# Altium project Tesis.PrjPcb (part 2 of 2)

## Sheet Fly-Back.SchDoc
size A4; DocumentNumber: 3; SheetNumber: 3; SheetTotal: 5
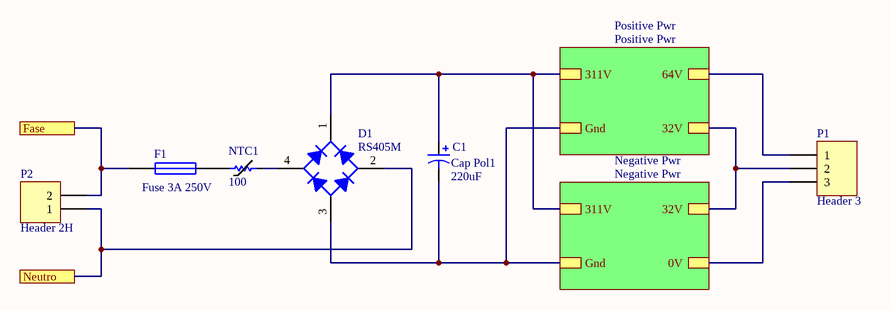
[diagram p12: Fly-Back.SchDoc]

### Parts
C1  Cap Pol1  value 220uF  [cap rad 100mm]
D1  RS405M  [RS405M]
F1  Fuse 3A 250V  [FUSE 3A]
NTC1  VALOR: 100  [RAD-0.3]  (hidden comment: Termistor NTC)
P1  Header 3  [bornera 3]
P2  Header 2H  [bornera 2]

### Sub-sheets
Negative Pwr = Negative Pwr: 311V, Gnd, 32V, 0V
Positive Pwr = Positive Pwr: 311V, Gnd, 64V, 32V

### Ports
Fase, Neutro

### Nets
Net*1_1: C1.1 D1.1(K) ; sheet Positive Pwr/311V, sheet Negative Pwr/311V
Net*1_3: C1.2 D1.3(A) ; sheet Positive Pwr/Gnd, sheet Negative Pwr/Gnd
Net*1_5: P1.2 ; sheet Positive Pwr/32V, sheet Negative Pwr/32V
Net*2_5: P1.3 ; sheet Negative Pwr/0V
NetC45_1: P1.1 ; sheet Positive Pwr/64V
NetD1_2: D1.2(C) P2.1 ; port Neutro
NetD1_4: D1.4(C) NTC1.1
NetF1_1: F1.1 P2.2 ; port Fase
NetF1_2: F1.2 NTC1.2

### Library data of the parts
C1 = Cap Pol1: Polarized Capacitor (Radial); Published: 8-Jun-2000; LatestRevisionDate: 17-Jul-2002; LatestRevisionNote: Re-released for DXP Platform.; PackageReference: RB7.6-15; Publisher: Altium Limited; PackageDescription: Polarized Capacitor (Radial); 2 Leads
D1 = Bridge1: Full Wave Diode Bridge; Published: 8-Jun-2000; LatestRevisionDate: 29-May-2009; LatestRevisionNote: Sch pins A & K swapped.; DatasheetVersion: E2732B; PackageReference: D-38; Publisher: Altium Limited; PackageDescription: Bridge Rectifier; 4 Terminals; Body 9.4 x 9.4 mm (typ); Pitch 5.08 mm
F1 = Fuse 1: Fuse; Published: 8-Jun-2000; LatestRevisionDate: 17-Jul-2002; LatestRevisionNote: Re-released for DXP Platform.; PackageReference: PIN-W2/E2.8; Publisher: Altium Limited; PackageDescription: Thru-Hole; 2 Leads
NTC1 = Termistor NTC: Termistor NTC SMD; PROVEEDOR: *; CODIGO STI: *; FABRICANTE: *
P1 = Header 3: Header, 3-Pin; LatestRevisionDate: 17-Jul-2002; LatestRevisionNote: Re-released for DXP Platform.; Publisher: Altium Limited
P2 = Header 2H: Header, 2-Pin, Right Angle; LatestRevisionDate: 17-Jul-2002; LatestRevisionNote: Re-released for DXP Platform.; Publisher: Altium Limited

## Sheet Positive Pwr.SchDoc
size A4
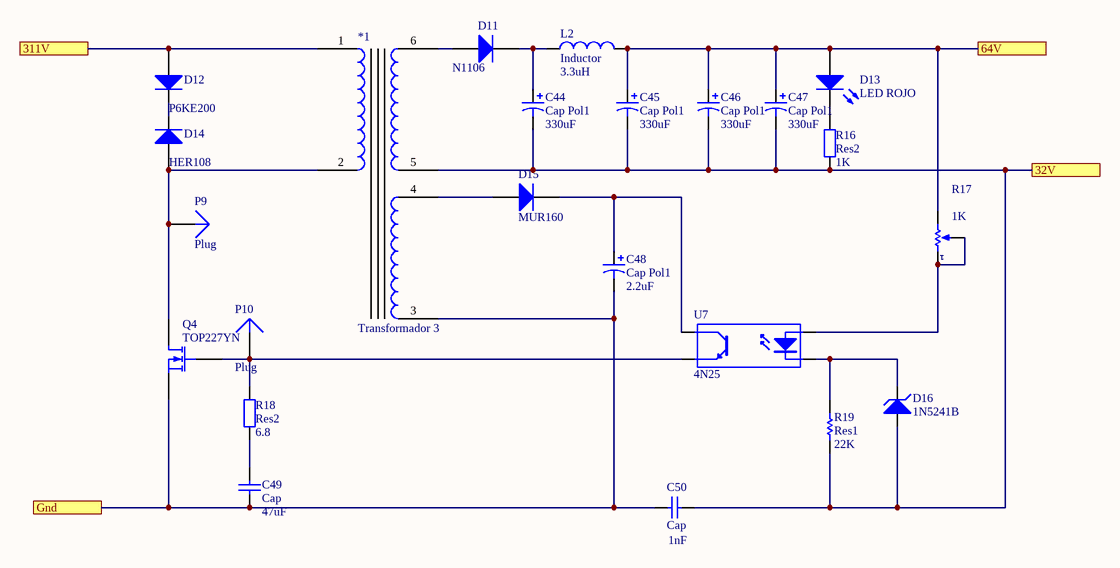
[diagram p13: Positive Pwr.SchDoc]

### Parts
*1  Transformador 3  [Transformador_flyback - duplicate]
C44  Cap Pol1  value 330uF  [CAPR D500 H1200 R200 mil]
C45  Cap Pol1  value 330uF  [CAPR D500 H1200 R200 mil]
C46  Cap Pol1  value 330uF  [CAPR D500 H1200 R200 mil]
C47  Cap Pol1  value 330uF  [CAPR D500 H1200 R200 mil]
C48  Cap Pol1  value 2.2uF  [CAPR D200 H450 R100 mil]
C49  Cap  value 47uF  [CAPR D250 H450 R100 mil]
C50  Cap  value 1nF  [RAD-0.2]
D11  N1106  [TO-220_A]
D12  P6KE200  [DO-15]
D13  LED ROJO  [Led 5mm ROJO]
D14  HER108  [DO-41]
D15  MUR160  [DO-41]
D16  VALOR: 1N5241B  [DO-41]  (hidden comment: Diodo Zener)
L2  Inductor  value 3.3uH  [Bobina 1.5*3]
P9  Plug  [PIN1]
P10  Plug  [PIN1]
Q4  TOP227YN  [TO-220AB]
R16  Res2  value 1K  [1206 resistor]
R17  VALOR: 1K  [Trimpot Horizontal]  (hidden comment: Trimpot)
R18  Res2  value 6.8  [1206 resistor]
R19  Res1  value 22K  [1206 resistor]
U7  4N25  [DIP-4]

### Ports
32V, 64V, 311V, Gnd

### Nets
Net*1_1: *1.1(L) D12.1(A) ; port 311V
Net*1_2: *1.2(L) D14.1(A) P9.1 Q4.3(D)
Net*1_3: *1.3(L) C48.2 C49.1 C50.1 Q4.2(S) ; port Gnd
Net*1_4: *1.4(L) D15.1(A)
Net*1_5: *1.5(L) C44.2 C45.2 C46.2 C47.2 C50.2 D16.1(A) R16.1 R19.1 ; port 32V
Net*1_6: *1.6(L) D11.3(A)
NetC44_1: C44.1 D11.1(K) L2.1
NetC45_1: C45.1 C46.1 C47.1 D13.1(A) L2.2 R17.2(BOT) ; port 64V
NetC48_1: C48.1 D15.2(K) U7.4(C)
NetC49_2: C49.2 R18.1
NetD12_2: D12.2(K) D14.2(K)
NetD13_2: D13.2(K) R16.2
NetD16_2: D16.2(K) R19.2 U7.2(K)
NetP10_1: P10.1 Q4.1(G) R18.2 U7.3(E)
NetR17_1: R17.1(TOP) R17.3(TAP) U7.1(A)

### Library data of the parts
C44-C48 = Cap Pol1: Polarized Capacitor (Radial); Published: 8-Jun-2000; LatestRevisionDate: 17-Jul-2002; LatestRevisionNote: Re-released for DXP Platform.; PackageReference: RB7.6-15; Publisher: Altium Limited; PackageDescription: Polarized Capacitor (Radial); 2 Leads
C49 C50 = Cap: Capacitor; Published: 8-Jun-2000; LatestRevisionDate: 17-Jul-2002; LatestRevisionNote: Re-released for DXP Platform.; PackageReference: RAD-0.3; Publisher: Altium Limited; PackageDescription: Radial Cap, Thru-Hole; 2 Leads; 0.3 in Pin Spacing
D11 D12 D14 D15 = Diode 1N4148: High Conductance Fast Diode; Published: 8-Jun-2000; LatestRevisionDate: 17-Jul-2002; LatestRevisionNote: Re-released for DXP Platform.; DatasheetVersion: 1997; PackageReference: DO-35; Publisher: Altium Limited; PackageDescription: Diode, Axial; Body 3.8 x 1.9 mm (LxDia. max), Lead Dia. 0.53 mm (max); Code_JEDEC: DO-204-AH; ComponentLink1Description: Manufacturer Link; ComponentLink1URL: http://www.fairchildsemi.com/; ComponentLink2Description: Datasheet; ComponentLink2URL: http://www.fairchildsemi.com/ds/1N%2F1N4148.pdf
D13 = LED0: Typical INFRARED GaAs LED; Published: 8-Jun-2000; LatestRevisionDate: 08-Jul-2005; LatestRevisionNote: Mech Layer 1 removed.; PackageReference: LED-0; Publisher: Altium Limited; PackageDescription: LED; 2 Leads
L2 = Inductor: Code_IEC: 1005; Published: 8-Jun-2000; LatestRevisionDate: 29-May-2009; LatestRevisionNote: IPC-7351 Footprint Added.; PackageReference: 0402-A; Publisher: Altium Limited; PackageDescription: Chip Inductor; Code_JEITA: 0402
Q4 = MOSFET-N: N-Channel MOSFET; Published: 8-Jun-2000; LatestRevisionDate: 17-Jul-2002; LatestRevisionNote: Re-released for DXP Platform.; PackageVersion: 1995/1996; PackageReference: E3; Publisher: Altium Limited; PackageDescription: TO, Flat Index; 3 In-Line, Axial Leads; Body Dia. 4.6mm; Lead Dia. 0.5 mm (max)
R16 R18 = Res2: Resistor; Published: 8-Jun-2000; LatestRevisionDate: 17-Jul-2002; LatestRevisionNote: Re-released for DXP Platform.; PackageReference: AXIAL-0.4; Publisher: Altium Limited; PackageDescription: Axial Device, Thru-Hole; 2 Leads; 0.4 in Pin Spacing
R17 = Trimpot: Preset; CODIGO STI: *; PROVEEDOR: *; FABRICANTE: *
R19 = Res1: Resistor; Published: 8-Jun-2000; LatestRevisionDate: 17-Jul-2002; LatestRevisionNote: Re-released for DXP Platform.; PackageReference: AXIAL-0.3; Publisher: Altium Limited; PackageDescription: Axial Device, Thru-Hole; 2 Leads; 0.3 in Pin Spacing
U7 = Optoisolator1: 4-Pin Phototransistor Optocoupler; Published: 24-Mar-1999; LatestRevisionDate: 04-Mar-2005; LatestRevisionNote: Sch pins 3 & 4 Swapped.; DatasheetVersion: Nov-2003; PackageReference: DIP-4; Publisher: Altium Limited
D16 = Diodo Zener: CODIGO STI: *; PROVEEDOR: *; FABRICANTE: *
P9 P10 = Plug: LatestRevisionDate: 17-Jul-2002; LatestRevisionNote: Re-released for DXP Platform.; Publisher: Altium Limited

## Sheet Negative Pwr.SchDoc
size A4
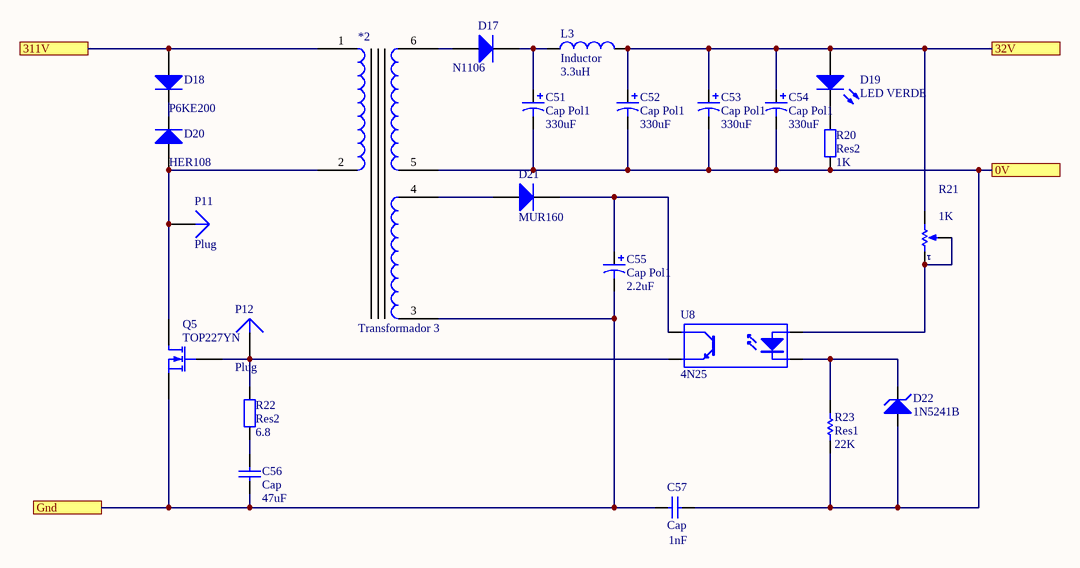
[diagram p14: Negative Pwr.SchDoc]

### Parts
*2  Transformador 3  [Transformador_flyback - duplicate]
C51  Cap Pol1  value 330uF  [CAPR D500 H1200 R200 mil]
C52  Cap Pol1  value 330uF  [CAPR D500 H1200 R200 mil]
C53  Cap Pol1  value 330uF  [CAPR D500 H1200 R200 mil]
C54  Cap Pol1  value 330uF  [CAPR D500 H1200 R200 mil]
C55  Cap Pol1  value 2.2uF  [CAPR D200 H450 R100 mil]
C56  Cap  value 47uF  [CAPR D250 H450 R100 mil]
C57  Cap  value 1nF  [RAD-0.2]
D17  N1106  [TO-220_A]
D18  P6KE200  [DO-15]
D19  LED VERDE  [Led 5mm ROJO]
D20  HER108  [DO-41]
D21  MUR160  [DO-41]
D22  VALOR: 1N5241B  [DO-41]  (hidden comment: Diodo Zener)
L3  Inductor  value 3.3uH  [Bobina 1.5*3]
P11  Plug  [PIN1]
P12  Plug  [PIN1]
Q5  TOP227YN  [TO-220AB]
R20  Res2  value 1K  [1206 resistor]
R21  VALOR: 1K  [Trimpot Horizontal]  (hidden comment: Trimpot)
R22  Res2  value 6.8  [1206 resistor]
R23  Res1  value 22K  [1206 resistor]
U8  4N25  [DIP-4]

### Ports
0V, 32V, 311V, Gnd

### Nets
Net*1_1: *2.1(L) D18.1(A) ; port 311V
Net*1_3: *2.3(L) C55.2 C56.1 C57.1 Q5.2(S) ; port Gnd
Net*1_5: C52.1 C53.1 C54.1 D19.1(A) L3.2 R21.2(BOT) ; port 32V
Net*2_2: *2.2(L) D20.1(A) P11.1 Q5.3(D)
Net*2_4: *2.4(L) D21.1(A)
Net*2_5: *2.5(L) C51.2 C52.2 C53.2 C54.2 C57.2 D22.1(A) R20.1 R23.1 ; port 0V
Net*2_6: *2.6(L) D17.3(A)
NetC51_1: C51.1 D17.1(K) L3.1
NetC55_1: C55.1 D21.2(K) U8.4(C)
NetC56_2: C56.2 R22.1
NetD18_2: D18.2(K) D20.2(K)
NetD19_2: D19.2(K) R20.2
NetD22_2: D22.2(K) R23.2 U8.2(K)
NetP12_1: P12.1 Q5.1(G) R22.2 U8.3(E)
NetR21_1: R21.1(TOP) R21.3(TAP) U8.1(A)

### Library data of the parts
C51-C55 = Cap Pol1: Polarized Capacitor (Radial); Published: 8-Jun-2000; LatestRevisionDate: 17-Jul-2002; LatestRevisionNote: Re-released for DXP Platform.; PackageReference: RB7.6-15; Publisher: Altium Limited; PackageDescription: Polarized Capacitor (Radial); 2 Leads
C56 C57 = Cap: Capacitor; Published: 8-Jun-2000; LatestRevisionDate: 17-Jul-2002; LatestRevisionNote: Re-released for DXP Platform.; PackageReference: RAD-0.3; Publisher: Altium Limited; PackageDescription: Radial Cap, Thru-Hole; 2 Leads; 0.3 in Pin Spacing
D17 D18 D20 D21 = Diode 1N4148: High Conductance Fast Diode; Published: 8-Jun-2000; LatestRevisionDate: 17-Jul-2002; LatestRevisionNote: Re-released for DXP Platform.; DatasheetVersion: 1997; PackageReference: DO-35; Publisher: Altium Limited; PackageDescription: Diode, Axial; Body 3.8 x 1.9 mm (LxDia. max), Lead Dia. 0.53 mm (max); Code_JEDEC: DO-204-AH; ComponentLink1Description: Manufacturer Link; ComponentLink1URL: http://www.fairchildsemi.com/; ComponentLink2Description: Datasheet; ComponentLink2URL: http://www.fairchildsemi.com/ds/1N%2F1N4148.pdf
D19 = LED0: Typical INFRARED GaAs LED; Published: 8-Jun-2000; LatestRevisionDate: 08-Jul-2005; LatestRevisionNote: Mech Layer 1 removed.; PackageReference: LED-0; Publisher: Altium Limited; PackageDescription: LED; 2 Leads
L3 = Inductor: Code_IEC: 1005; Published: 8-Jun-2000; LatestRevisionDate: 29-May-2009; LatestRevisionNote: IPC-7351 Footprint Added.; PackageReference: 0402-A; Publisher: Altium Limited; PackageDescription: Chip Inductor; Code_JEITA: 0402
Q5 = MOSFET-N: N-Channel MOSFET; Published: 8-Jun-2000; LatestRevisionDate: 17-Jul-2002; LatestRevisionNote: Re-released for DXP Platform.; PackageVersion: 1995/1996; PackageReference: E3; Publisher: Altium Limited; PackageDescription: TO, Flat Index; 3 In-Line, Axial Leads; Body Dia. 4.6mm; Lead Dia. 0.5 mm (max)
R20 R22 = Res2: Resistor; Published: 8-Jun-2000; LatestRevisionDate: 17-Jul-2002; LatestRevisionNote: Re-released for DXP Platform.; PackageReference: AXIAL-0.4; Publisher: Altium Limited; PackageDescription: Axial Device, Thru-Hole; 2 Leads; 0.4 in Pin Spacing
R21 = Trimpot: Preset; CODIGO STI: *; PROVEEDOR: *; FABRICANTE: *
R23 = Res1: Resistor; Published: 8-Jun-2000; LatestRevisionDate: 17-Jul-2002; LatestRevisionNote: Re-released for DXP Platform.; PackageReference: AXIAL-0.3; Publisher: Altium Limited; PackageDescription: Axial Device, Thru-Hole; 2 Leads; 0.3 in Pin Spacing
U8 = Optoisolator1: 4-Pin Phototransistor Optocoupler; Published: 24-Mar-1999; LatestRevisionDate: 04-Mar-2005; LatestRevisionNote: Sch pins 3 & 4 Swapped.; DatasheetVersion: Nov-2003; PackageReference: DIP-4; Publisher: Altium Limited
D22 = Diodo Zener: CODIGO STI: *; PROVEEDOR: *; FABRICANTE: *
P11 P12 = Plug: LatestRevisionDate: 17-Jul-2002; LatestRevisionNote: Re-released for DXP Platform.; Publisher: Altium Limited

## Nets that join several sheets
12V: Amplificador Clase D (15 pins), Triangular (5 pins), Filtros (*3.3 C111.1 C112.1 C113.1), Pasa Bajos (U9.4), Pasa Altos (U9.4), Pasa Banda Inferior (U10.4), Pasa Banda Superior (U11.4), Micro y BT (5 pins)
-12V: Amplificador Clase D (12 pins), Triangular (RP5.2 U5.4), Filtros (*3.1 C114.2 C115.2 C116.2), Pasa Bajos (U9.11), Pasa Altos (U9.11), Pasa Banda Inferior (U10.11), Pasa Banda Superior (U11.11), Micro y BT (P20.1 RP12.1 U15.11)
-20V: Amplificador Clase D (C6.1 C15.2 C16.2 U1.3), Generador De Retardo (1.1), Mosfet Driver (6 pins)
-32V: Amplificador Clase D (12 pins), Generador De Retardo (1.8 C36.1 C37.1), Mosfet Driver (7 pins)
GND: Amplificador Clase D (20 pins), Triangular (5 pins), Feedback (B1.2 C58.1), Filtros (12 pins), Pasa Bajos (C72.1 C73.1 C74.2 C75.2), Pasa Altos (R35.1 R37.2), Pasa Banda Inferior (13 pins), Pasa Banda Superior (13 pins), Micro y BT (45 pins)
Net1_3: Amplificador Clase D (R3.1 R4.2), Generador De Retardo (1.3 1.5)
Net1_6: Generador De Retardo (1.6), Mosfet Driver (U6.12)
Net1_12: Generador De Retardo (1.12), Mosfet Driver (U6.10)
Net*1_1: Fly-Back (C1.1 D1.1), Positive Pwr (*1.1 D12.1), Negative Pwr (*2.1 D18.1)
Net*1_3: Fly-Back (C1.2 D1.3), Positive Pwr (5 pins), Negative Pwr (5 pins)
Net*1_5: Fly-Back (P1.2), Positive Pwr (9 pins), Negative Pwr (6 pins)
Net*2_5: Fly-Back (P1.3), Negative Pwr (9 pins)
NetC23_1: Amplificador Clase D (7 pins), Mosfet Driver (5 pins), Feedback (P13.3)
NetC24_2: Amplificador Clase D (8 pins), Feedback (P13.2)
NetC45_1: Fly-Back (P1.1), Positive Pwr (6 pins)
NetC59_2: Filtros (W6.2), Pasa Altos (C59.2 C63.2)
NetC68_2: Filtros (RP7.2), Pasa Bajos (C68.2 C70.2 R40.2 U9.7)
NetD8_1: Amplificador Clase D (Q2.1), Mosfet Driver (D8.1 R12.2 R13.2)
NetD10_1: Amplificador Clase D (Q3.1), Mosfet Driver (D10.1 R14.1 R15.1)
NetP14_2: Amplificador Clase D (RP1.2), Feedback (P14.2)
NetR7_1: Amplificador Clase D (U2.2), Triangular (R7.1 RP5.3)
NetR29_1: Filtros (RP10.2), Pasa Altos (R29.1 R31.1 U9.14)
NetR41_1: Filtros (W3.2), Pasa Bajos (R41.1)
NetR55_2: Filtros (RP8.2), Pasa Banda Inferior (R55.2 R61.2 U10.14)
NetR62_1: Filtros (W4.2), Pasa Banda Inferior (R62.1)
NetR83_2: Filtros (RP9.2), Pasa Banda Superior (R83.2 R91.2 U11.14)
NetR92_1: Filtros (W5.2), Pasa Banda Superior (R92.1)